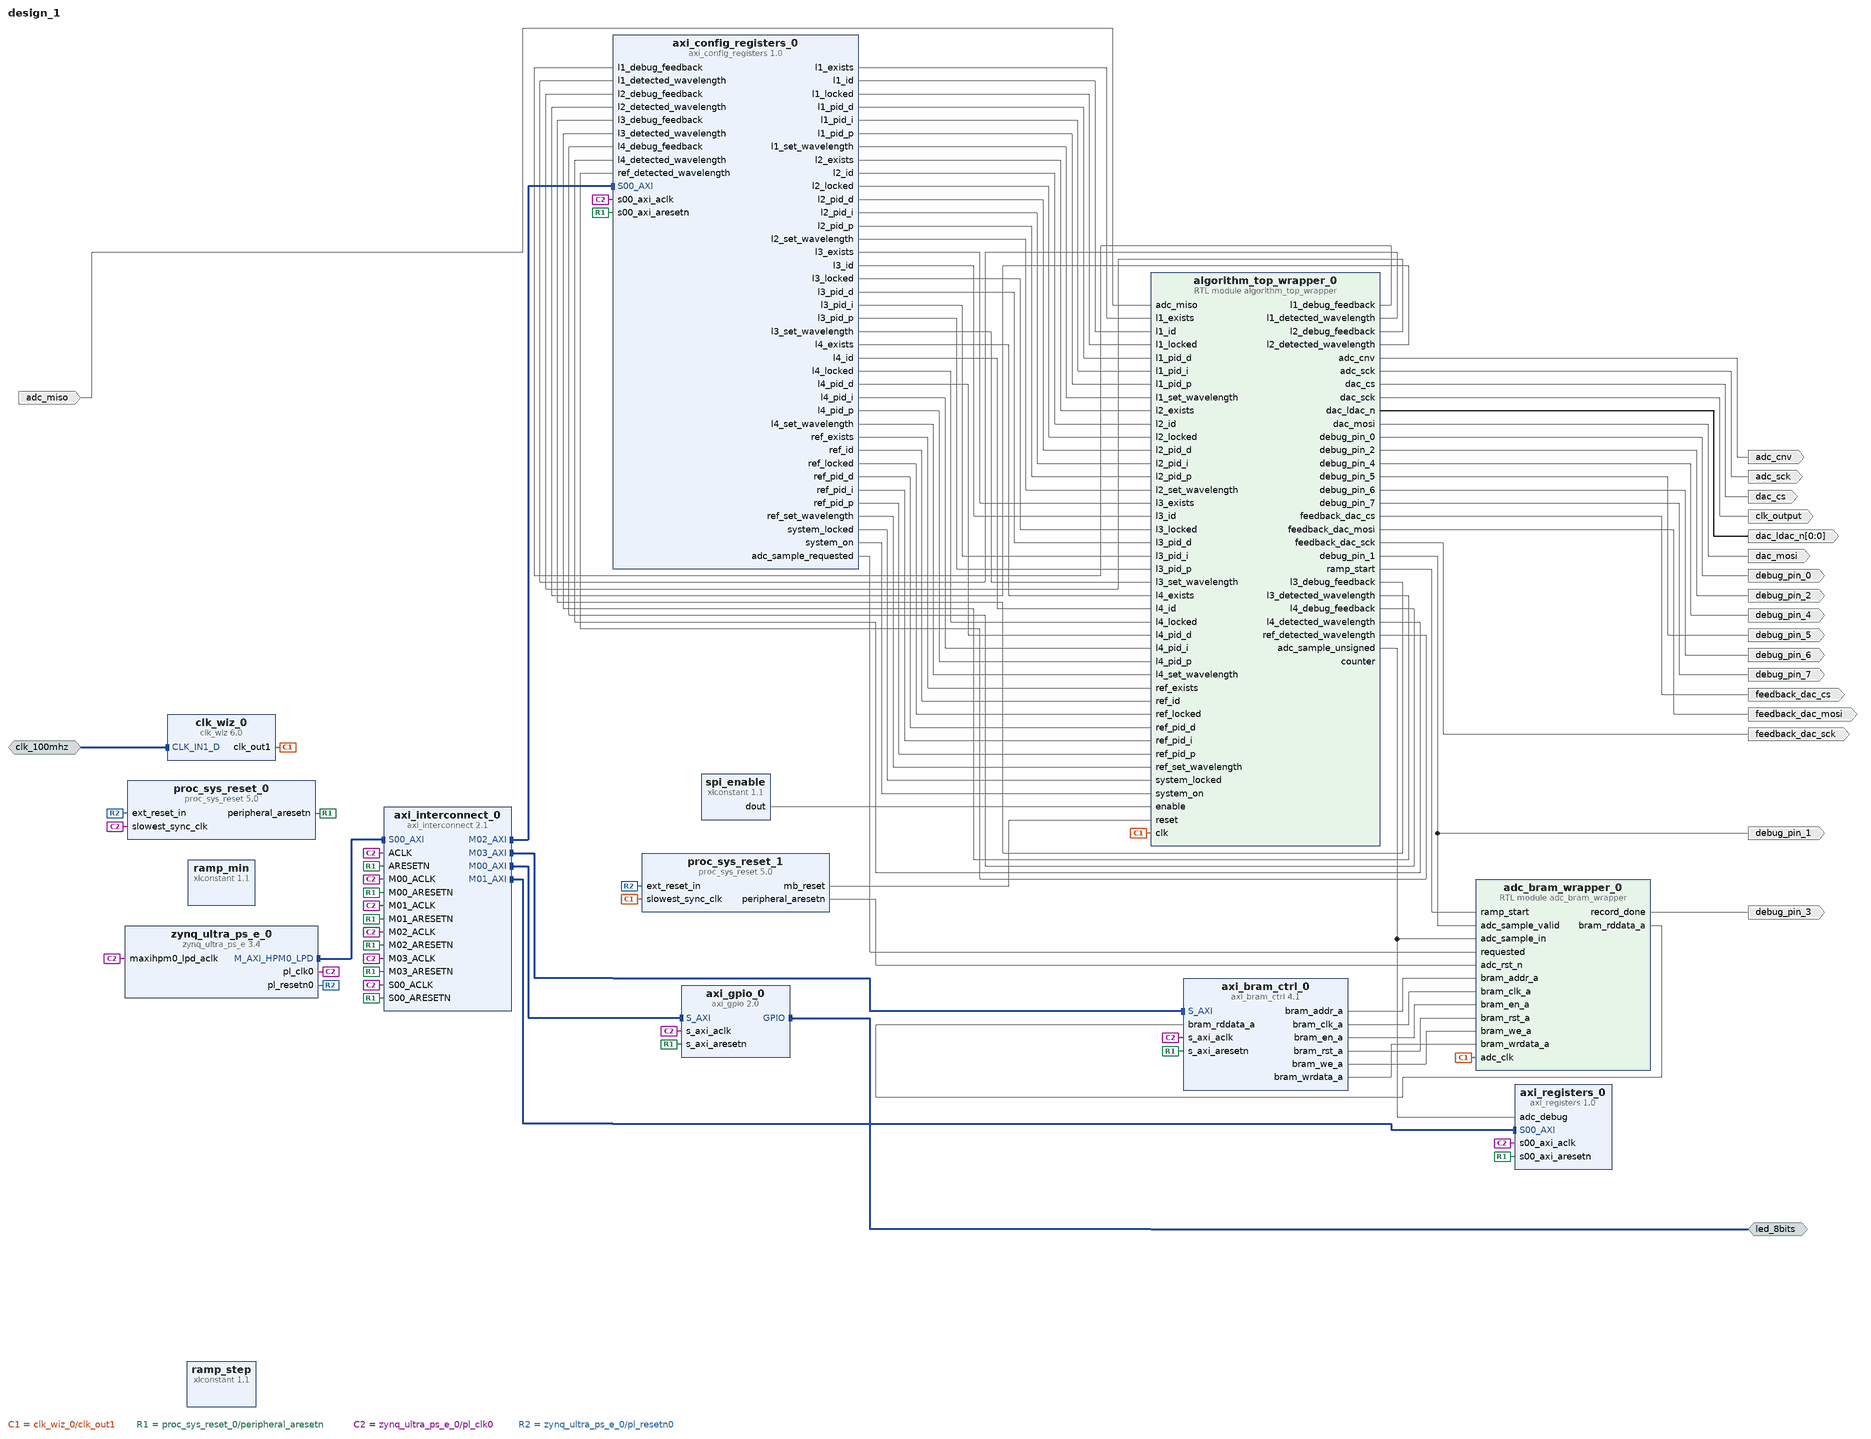
[diagram p0: block diagram of the top level]
# Vivado block design design_1, xczu3eg-sfvc784-2-e, Vivado 2022.1
create_bd_design design_1

create_bd_intf_port -mode Master -vlnv xilinx.com:interface:gpio_rtl:1.0 led_8bits
create_bd_intf_port -mode Slave -vlnv xilinx.com:interface:diff_clock_rtl:1.0 clk_100mhz
set_property -dict {CONFIG.FREQ_HZ 100000000} [get_bd_intf_ports clk_100mhz]
create_bd_port -dir O -type data clk_output
create_bd_port -dir O -type data dac_cs
create_bd_port -dir O -type data dac_mosi
create_bd_port -dir O -from 0 -to 0 -type data dac_ldac_n
create_bd_port -dir I -type data adc_miso
create_bd_port -dir O -type data adc_cnv
create_bd_port -dir O -type data adc_sck
create_bd_port -dir O -type data feedback_dac_mosi
create_bd_port -dir O -type data feedback_dac_sck
create_bd_port -dir O -type data feedback_dac_cs
create_bd_port -dir O -type data debug_pin_0
create_bd_port -dir O -type data debug_pin_1
create_bd_port -dir O -type data debug_pin_2
create_bd_port -dir O -type data debug_pin_3
create_bd_port -dir O -type data debug_pin_4
create_bd_port -dir O -type data debug_pin_5
create_bd_port -dir O -type data debug_pin_6
create_bd_port -dir O -type data debug_pin_7

create_bd_cell -type ip -vlnv xilinx.com:ip:zynq_ultra_ps_e:3.4 zynq_ultra_ps_e_0
set_property -dict [list \
  CONFIG.CAN0_BOARD_INTERFACE custom \
  CONFIG.CAN1_BOARD_INTERFACE custom \
  CONFIG.CSU_BOARD_INTERFACE custom \
  CONFIG.DP_BOARD_INTERFACE custom \
  CONFIG.GEM0_BOARD_INTERFACE custom \
  CONFIG.GEM1_BOARD_INTERFACE custom \
  CONFIG.GEM2_BOARD_INTERFACE custom \
  CONFIG.GEM3_BOARD_INTERFACE custom \
  CONFIG.GPIO_BOARD_INTERFACE custom \
  CONFIG.IIC0_BOARD_INTERFACE custom \
  CONFIG.IIC1_BOARD_INTERFACE custom \
  CONFIG.NAND_BOARD_INTERFACE custom \
  CONFIG.PCIE_BOARD_INTERFACE custom \
  CONFIG.PJTAG_BOARD_INTERFACE custom \
  CONFIG.PMU_BOARD_INTERFACE custom \
  CONFIG.PSU_BANK_0_IO_STANDARD LVCMOS33 \
  CONFIG.PSU_BANK_1_IO_STANDARD LVCMOS33 \
  CONFIG.PSU_BANK_2_IO_STANDARD LVCMOS33 \
  CONFIG.PSU_BANK_3_IO_STANDARD LVCMOS18 \
  CONFIG.PSU_USB3__DUAL_CLOCK_ENABLE 1 \
  CONFIG.PSU__CAN1__PERIPHERAL__ENABLE 0 \
  CONFIG.PSU__CRF_APB__ACPU_CTRL__FREQMHZ 1200 \
  CONFIG.PSU__CRF_APB__ACPU_CTRL__SRCSEL APLL \
  CONFIG.PSU__CRF_APB__APLL_CTRL__SRCSEL PSS_REF_CLK \
  CONFIG.PSU__CRF_APB__DBG_FPD_CTRL__FREQMHZ 250 \
  CONFIG.PSU__CRF_APB__DBG_FPD_CTRL__SRCSEL IOPLL \
  CONFIG.PSU__CRF_APB__DBG_TRACE_CTRL__FREQMHZ 250 \
  CONFIG.PSU__CRF_APB__DBG_TRACE_CTRL__SRCSEL IOPLL \
  CONFIG.PSU__CRF_APB__DBG_TSTMP_CTRL__FREQMHZ 250 \
  CONFIG.PSU__CRF_APB__DBG_TSTMP_CTRL__SRCSEL IOPLL \
  CONFIG.PSU__CRF_APB__DDR_CTRL__FREQMHZ 1200 \
  CONFIG.PSU__CRF_APB__DDR_CTRL__SRCSEL DPLL \
  CONFIG.PSU__CRF_APB__DPDMA_REF_CTRL__FREQMHZ 600 \
  CONFIG.PSU__CRF_APB__DPDMA_REF_CTRL__SRCSEL DPLL \
  CONFIG.PSU__CRF_APB__DPLL_CTRL__SRCSEL PSS_REF_CLK \
  CONFIG.PSU__CRF_APB__DP_AUDIO_REF_CTRL__SRCSEL RPLL \
  CONFIG.PSU__CRF_APB__DP_STC_REF_CTRL__SRCSEL RPLL \
  CONFIG.PSU__CRF_APB__DP_VIDEO_REF_CTRL__SRCSEL DPLL \
  CONFIG.PSU__CRF_APB__GDMA_REF_CTRL__FREQMHZ 600 \
  CONFIG.PSU__CRF_APB__GDMA_REF_CTRL__SRCSEL DPLL \
  CONFIG.PSU__CRF_APB__GPU_REF_CTRL__FREQMHZ 600 \
  CONFIG.PSU__CRF_APB__GPU_REF_CTRL__SRCSEL DPLL \
  CONFIG.PSU__CRF_APB__TOPSW_LSBUS_CTRL__FREQMHZ 100 \
  CONFIG.PSU__CRF_APB__TOPSW_LSBUS_CTRL__SRCSEL IOPLL \
  CONFIG.PSU__CRF_APB__TOPSW_MAIN_CTRL__FREQMHZ 533.333 \
  CONFIG.PSU__CRF_APB__TOPSW_MAIN_CTRL__SRCSEL DPLL \
  CONFIG.PSU__CRF_APB__VPLL_CTRL__SRCSEL PSS_REF_CLK \
  CONFIG.PSU__CRL_APB__ADMA_REF_CTRL__FREQMHZ 533.333 \
  CONFIG.PSU__CRL_APB__ADMA_REF_CTRL__SRCSEL RPLL \
  CONFIG.PSU__CRL_APB__CAN1_REF_CTRL__FREQMHZ 100 \
  CONFIG.PSU__CRL_APB__CAN1_REF_CTRL__SRCSEL IOPLL \
  CONFIG.PSU__CRL_APB__CPU_R5_CTRL__FREQMHZ 500 \
  CONFIG.PSU__CRL_APB__CPU_R5_CTRL__SRCSEL IOPLL \
  CONFIG.PSU__CRL_APB__DBG_LPD_CTRL__FREQMHZ 250 \
  CONFIG.PSU__CRL_APB__DBG_LPD_CTRL__SRCSEL IOPLL \
  CONFIG.PSU__CRL_APB__GEM3_REF_CTRL__FREQMHZ 125 \
  CONFIG.PSU__CRL_APB__GEM3_REF_CTRL__SRCSEL IOPLL \
  CONFIG.PSU__CRL_APB__I2C0_REF_CTRL__FREQMHZ 100 \
  CONFIG.PSU__CRL_APB__I2C0_REF_CTRL__SRCSEL IOPLL \
  CONFIG.PSU__CRL_APB__I2C1_REF_CTRL__FREQMHZ 100 \
  CONFIG.PSU__CRL_APB__I2C1_REF_CTRL__SRCSEL IOPLL \
  CONFIG.PSU__CRL_APB__IOPLL_CTRL__SRCSEL PSS_REF_CLK \
  CONFIG.PSU__CRL_APB__IOU_SWITCH_CTRL__FREQMHZ 267 \
  CONFIG.PSU__CRL_APB__IOU_SWITCH_CTRL__SRCSEL RPLL \
  CONFIG.PSU__CRL_APB__LPD_LSBUS_CTRL__FREQMHZ 100 \
  CONFIG.PSU__CRL_APB__LPD_LSBUS_CTRL__SRCSEL IOPLL \
  CONFIG.PSU__CRL_APB__LPD_SWITCH_CTRL__FREQMHZ 533.333 \
  CONFIG.PSU__CRL_APB__LPD_SWITCH_CTRL__SRCSEL RPLL \
  CONFIG.PSU__CRL_APB__PCAP_CTRL__FREQMHZ 200 \
  CONFIG.PSU__CRL_APB__PCAP_CTRL__SRCSEL IOPLL \
  CONFIG.PSU__CRL_APB__PL0_REF_CTRL__FREQMHZ 100 \
  CONFIG.PSU__CRL_APB__PL0_REF_CTRL__SRCSEL IOPLL \
  CONFIG.PSU__CRL_APB__QSPI_REF_CTRL__FREQMHZ 300 \
  CONFIG.PSU__CRL_APB__QSPI_REF_CTRL__SRCSEL IOPLL \
  CONFIG.PSU__CRL_APB__RPLL_CTRL__SRCSEL PSS_REF_CLK \
  CONFIG.PSU__CRL_APB__SDIO0_REF_CTRL__SRCSEL IOPLL \
  CONFIG.PSU__CRL_APB__SDIO1_REF_CTRL__FREQMHZ 200 \
  CONFIG.PSU__CRL_APB__SDIO1_REF_CTRL__SRCSEL RPLL \
  CONFIG.PSU__CRL_APB__TIMESTAMP_REF_CTRL__FREQMHZ 100 \
  CONFIG.PSU__CRL_APB__TIMESTAMP_REF_CTRL__SRCSEL PSS_REF_CLK \
  CONFIG.PSU__CRL_APB__UART0_REF_CTRL__FREQMHZ 100 \
  CONFIG.PSU__CRL_APB__UART0_REF_CTRL__SRCSEL IOPLL \
  CONFIG.PSU__CRL_APB__UART1_REF_CTRL__FREQMHZ 100 \
  CONFIG.PSU__CRL_APB__UART1_REF_CTRL__SRCSEL IOPLL \
  CONFIG.PSU__CRL_APB__USB0_BUS_REF_CTRL__FREQMHZ 250 \
  CONFIG.PSU__CRL_APB__USB0_BUS_REF_CTRL__SRCSEL IOPLL \
  CONFIG.PSU__CRL_APB__USB3_DUAL_REF_CTRL__FREQMHZ 20 \
  CONFIG.PSU__CRL_APB__USB3_DUAL_REF_CTRL__SRCSEL IOPLL \
  CONFIG.PSU__CRL_APB__USB3__ENABLE 1 \
  CONFIG.PSU__CSUPMU__PERIPHERAL__VALID 0 \
  CONFIG.PSU__DDRC__BUS_WIDTH {32 Bit} \
  CONFIG.PSU__DDRC__COMPONENTS Components \
  CONFIG.PSU__DDRC__DEVICE_CAPACITY {16384 MBits} \
  CONFIG.PSU__DDRC__DRAM_WIDTH {16 Bits} \
  CONFIG.PSU__DDRC__ECC Disabled \
  CONFIG.PSU__DDRC__MEMORY_TYPE {DDR 4} \
  CONFIG.PSU__DDRC__SPEED_BIN DDR4_2400T \
  CONFIG.PSU__DDR_HIGH_ADDRESS_GUI_ENABLE 1 \
  CONFIG.PSU__DDR__INTERFACE__FREQMHZ 600.000 \
  CONFIG.PSU__DEVICE_TYPE EG \
  CONFIG.PSU__DISPLAYPORT__LANE0__ENABLE 1 \
  CONFIG.PSU__DISPLAYPORT__LANE0__IO {GT Lane1} \
  CONFIG.PSU__DISPLAYPORT__LANE1__ENABLE 1 \
  CONFIG.PSU__DISPLAYPORT__LANE1__IO {GT Lane0} \
  CONFIG.PSU__DISPLAYPORT__PERIPHERAL__ENABLE 1 \
  CONFIG.PSU__DLL__ISUSED 1 \
  CONFIG.PSU__DPAUX__PERIPHERAL__ENABLE 1 \
  CONFIG.PSU__DPAUX__PERIPHERAL__IO {MIO 27 .. 30} \
  CONFIG.PSU__DP__LANE_SEL {Dual Lower} \
  CONFIG.PSU__DP__REF_CLK_FREQ 27 \
  CONFIG.PSU__DP__REF_CLK_SEL {Ref Clk0} \
  CONFIG.PSU__ENET3__PERIPHERAL__ENABLE 0 \
  CONFIG.PSU__FPD_SLCR__WDT1__FREQMHZ 100 \
  CONFIG.PSU__FPGA_PL0_ENABLE 1 \
  CONFIG.PSU__GPIO0_MIO__IO {MIO 0 .. 25} \
  CONFIG.PSU__GPIO0_MIO__PERIPHERAL__ENABLE 1 \
  CONFIG.PSU__GPIO1_MIO__IO {MIO 26 .. 51} \
  CONFIG.PSU__GPIO1_MIO__PERIPHERAL__ENABLE 1 \
  CONFIG.PSU__GPIO2_MIO__IO {MIO 52 .. 77} \
  CONFIG.PSU__GPIO2_MIO__PERIPHERAL__ENABLE 1 \
  CONFIG.PSU__GT__LINK_SPEED HBR \
  CONFIG.PSU__GT__PRE_EMPH_LVL_4 0 \
  CONFIG.PSU__GT__VLT_SWNG_LVL_4 0 \
  CONFIG.PSU__I2C0__PERIPHERAL__ENABLE 1 \
  CONFIG.PSU__I2C0__PERIPHERAL__IO {MIO 34 .. 35} \
  CONFIG.PSU__I2C1__PERIPHERAL__ENABLE 1 \
  CONFIG.PSU__I2C1__PERIPHERAL__IO {MIO 36 .. 37} \
  CONFIG.PSU__IOU_SLCR__IOU_TTC_APB_CLK__TTC0_SEL APB \
  CONFIG.PSU__IOU_SLCR__IOU_TTC_APB_CLK__TTC1_SEL APB \
  CONFIG.PSU__IOU_SLCR__IOU_TTC_APB_CLK__TTC2_SEL APB \
  CONFIG.PSU__IOU_SLCR__IOU_TTC_APB_CLK__TTC3_SEL APB \
  CONFIG.PSU__IOU_SLCR__TTC0__FREQMHZ 100 \
  CONFIG.PSU__IOU_SLCR__TTC1__FREQMHZ 100 \
  CONFIG.PSU__IOU_SLCR__TTC2__FREQMHZ 100 \
  CONFIG.PSU__IOU_SLCR__TTC3__FREQMHZ 100 \
  CONFIG.PSU__IOU_SLCR__WDT0__FREQMHZ 100 \
  CONFIG.PSU__LPD_SLCR__CSUPMU__FREQMHZ 100 \
  CONFIG.PSU__OVERRIDE_HPX_QOS 0 \
  CONFIG.PSU__OVERRIDE__BASIC_CLOCK 0 \
  CONFIG.PSU__PMU__PERIPHERAL__ENABLE 0 \
  CONFIG.PSU__PRESET_APPLIED 1 \
  CONFIG.PSU__PSS_REF_CLK__FREQMHZ 33.33333 \
  CONFIG.PSU__QSPI__PERIPHERAL__ENABLE 0 \
  CONFIG.PSU__SATA__PERIPHERAL__ENABLE 0 \
  CONFIG.PSU__SD0__CLK_50_SDR_ITAP_DLY 0x15 \
  CONFIG.PSU__SD0__CLK_50_SDR_OTAP_DLY 0x5 \
  CONFIG.PSU__SD0__DATA_TRANSFER_MODE 4Bit \
  CONFIG.PSU__SD0__GRP_CD__ENABLE 1 \
  CONFIG.PSU__SD0__GRP_CD__IO {MIO 24} \
  CONFIG.PSU__SD0__PERIPHERAL__ENABLE 1 \
  CONFIG.PSU__SD0__PERIPHERAL__IO {MIO 13 .. 16 21 22} \
  CONFIG.PSU__SD0__SLOT_TYPE {SD 2.0} \
  CONFIG.PSU__SD1__CLK_100_SDR_OTAP_DLY 0x00 \
  CONFIG.PSU__SD1__CLK_200_SDR_OTAP_DLY 0x00 \
  CONFIG.PSU__SD1__CLK_50_DDR_ITAP_DLY 0x00 \
  CONFIG.PSU__SD1__CLK_50_DDR_OTAP_DLY 0x00 \
  CONFIG.PSU__SD1__CLK_50_SDR_ITAP_DLY 0x00 \
  CONFIG.PSU__SD1__CLK_50_SDR_OTAP_DLY 0x00 \
  CONFIG.PSU__SD1__PERIPHERAL__ENABLE 0 \
  CONFIG.PSU__SWDT0__PERIPHERAL__ENABLE 0 \
  CONFIG.PSU__SWDT1__PERIPHERAL__ENABLE 0 \
  CONFIG.PSU__TTC0__PERIPHERAL__ENABLE 0 \
  CONFIG.PSU__TTC1__PERIPHERAL__ENABLE 0 \
  CONFIG.PSU__TTC2__PERIPHERAL__ENABLE 0 \
  CONFIG.PSU__TTC3__PERIPHERAL__ENABLE 0 \
  CONFIG.PSU__UART0__PERIPHERAL__ENABLE 0 \
  CONFIG.PSU__UART1__BAUD_RATE 115200 \
  CONFIG.PSU__UART1__MODEM__ENABLE 0 \
  CONFIG.PSU__UART1__PERIPHERAL__ENABLE 1 \
  CONFIG.PSU__UART1__PERIPHERAL__IO {MIO 32 .. 33} \
  CONFIG.PSU__USB0_COHERENCY 0 \
  CONFIG.PSU__USB0__PERIPHERAL__ENABLE 1 \
  CONFIG.PSU__USB0__PERIPHERAL__IO {MIO 52 .. 63} \
  CONFIG.PSU__USB0__REF_CLK_FREQ 100 \
  CONFIG.PSU__USB0__REF_CLK_SEL {Ref Clk1} \
  CONFIG.PSU__USB0__RESET__ENABLE 1 \
  CONFIG.PSU__USB0__RESET__IO {MIO 76} \
  CONFIG.PSU__USB1__PERIPHERAL__ENABLE 1 \
  CONFIG.PSU__USB1__PERIPHERAL__IO {MIO 64 .. 75} \
  CONFIG.PSU__USB1__REF_CLK_FREQ 100 \
  CONFIG.PSU__USB1__REF_CLK_SEL {Ref Clk1} \
  CONFIG.PSU__USB2_0__EMIO__ENABLE 0 \
  CONFIG.PSU__USB3_0__EMIO__ENABLE 0 \
  CONFIG.PSU__USB3_0__PERIPHERAL__ENABLE 1 \
  CONFIG.PSU__USB3_0__PERIPHERAL__IO {GT Lane2} \
  CONFIG.PSU__USB3_1__PERIPHERAL__ENABLE 1 \
  CONFIG.PSU__USB3_1__PERIPHERAL__IO {GT Lane3} \
  CONFIG.PSU__USB__RESET__MODE {Shared MIO Pin} \
  CONFIG.PSU__USB__RESET__POLARITY {Active Low} \
  CONFIG.PSU__USE__IRQ0 1 \
  CONFIG.PSU__USE__M_AXI_GP0 0 \
  CONFIG.PSU__USE__M_AXI_GP1 0 \
  CONFIG.PSU__USE__M_AXI_GP2 1 \
  CONFIG.QSPI_BOARD_INTERFACE custom \
  CONFIG.SATA_BOARD_INTERFACE custom \
  CONFIG.SD0_BOARD_INTERFACE custom \
  CONFIG.SD1_BOARD_INTERFACE custom \
  CONFIG.SPI0_BOARD_INTERFACE custom \
  CONFIG.SPI1_BOARD_INTERFACE custom \
  CONFIG.SUBPRESET1 Custom \
  CONFIG.SUBPRESET2 Custom \
  CONFIG.SWDT0_BOARD_INTERFACE custom \
  CONFIG.SWDT1_BOARD_INTERFACE custom \
  CONFIG.TRACE_BOARD_INTERFACE custom \
  CONFIG.TTC0_BOARD_INTERFACE custom \
  CONFIG.TTC1_BOARD_INTERFACE custom \
  CONFIG.TTC2_BOARD_INTERFACE custom \
  CONFIG.TTC3_BOARD_INTERFACE custom \
  CONFIG.UART0_BOARD_INTERFACE custom \
  CONFIG.UART1_BOARD_INTERFACE custom \
  CONFIG.USB0_BOARD_INTERFACE custom \
  CONFIG.USB1_BOARD_INTERFACE custom \
  CONFIG.preset None \
] [get_bd_cells zynq_ultra_ps_e_0]
# 765 more settings of zynq_ultra_ps_e_0 are not shown: defaults, MIO pin electricals, DDR timing, and values the tool derives
create_bd_cell -type ip -vlnv xilinx.com:ip:proc_sys_reset:5.0 proc_sys_reset_0
create_bd_cell -type ip -vlnv xilinx.com:ip:clk_wiz:6.0 clk_wiz_0
set_property -dict [list \
  CONFIG.CLKOUT1_DRIVES Buffer \
  CONFIG.CLKOUT1_JITTER 144.719 \
  CONFIG.CLKOUT1_PHASE_ERROR 114.212 \
  CONFIG.CLKOUT1_REQUESTED_OUT_FREQ 100 \
  CONFIG.CLKOUT2_DRIVES Buffer \
  CONFIG.CLKOUT2_JITTER 144.719 \
  CONFIG.CLKOUT2_PHASE_ERROR 114.212 \
  CONFIG.CLKOUT2_USED false \
  CONFIG.CLKOUT3_DRIVES Buffer \
  CONFIG.CLKOUT4_DRIVES Buffer \
  CONFIG.CLKOUT5_DRIVES Buffer \
  CONFIG.CLKOUT6_DRIVES Buffer \
  CONFIG.CLKOUT7_DRIVES Buffer \
  CONFIG.CLK_IN1_BOARD_INTERFACE clk_100mhz \
  CONFIG.MMCM_BANDWIDTH OPTIMIZED \
  CONFIG.MMCM_CLKFBOUT_MULT_F 8 \
  CONFIG.MMCM_CLKOUT0_DIVIDE_F 8 \
  CONFIG.MMCM_CLKOUT1_DIVIDE 1 \
  CONFIG.MMCM_COMPENSATION AUTO \
  CONFIG.NUM_OUT_CLKS 1 \
  CONFIG.PRIMITIVE PLL \
  CONFIG.PRIM_SOURCE Differential_clock_capable_pin \
  CONFIG.USE_BOARD_FLOW true \
  CONFIG.USE_RESET false \
] [get_bd_cells clk_wiz_0]
create_bd_cell -type ip -vlnv xilinx.com:ip:xlconstant:1.1 ramp_step
set_property -dict {CONFIG.CONST_VAL 64 CONFIG.CONST_WIDTH 16} [get_bd_cells ramp_step]
create_bd_cell -type ip -vlnv xilinx.com:ip:xlconstant:1.1 ramp_min
set_property -dict {CONFIG.CONST_VAL 0 CONFIG.CONST_WIDTH 16} [get_bd_cells ramp_min]
create_bd_cell -type ip -vlnv xilinx.com:ip:xlconstant:1.1 spi_enable
set_property -dict {CONFIG.CONST_VAL 1 CONFIG.CONST_WIDTH 1} [get_bd_cells spi_enable]
create_bd_cell -type ip -vlnv xilinx.com:ip:proc_sys_reset:5.0 proc_sys_reset_1
create_bd_cell -type ip -vlnv xilinx.com:ip:axi_gpio:2.0 axi_gpio_0
set_property -dict [list \
  CONFIG.C_GPIO2_WIDTH 28 \
  CONFIG.C_IS_DUAL 1 \
  CONFIG.GPIO_BOARD_INTERFACE led_8bits \
  CONFIG.USE_BOARD_FLOW true \
] [get_bd_cells axi_gpio_0]
create_bd_cell -type ip -vlnv xilinx.com:ip:axi_interconnect:2.1 axi_interconnect_0
set_property -dict {CONFIG.NUM_MI 4} [get_bd_cells axi_interconnect_0]
create_bd_cell -type ip -vlnv user.org:user:axi_registers:1.0 axi_registers_0
create_bd_cell -type ip -vlnv xilinx.com:ip:axi_bram_ctrl:4.1 axi_bram_ctrl_0
set_property -dict {CONFIG.SINGLE_PORT_BRAM 1} [get_bd_cells axi_bram_ctrl_0]
create_bd_cell -type module -reference adc_bram_wrapper adc_bram_wrapper_0
create_bd_cell -type ip -vlnv user.org:user:axi_config_registers:1.0 axi_config_registers_0
create_bd_cell -type module -reference algorithm_top_wrapper algorithm_top_wrapper_0

# ---- connections ----

connect_bd_intf_net [get_bd_intf_ports led_8bits] [get_bd_intf_pins axi_gpio_0/GPIO]
connect_bd_intf_net [get_bd_intf_pins axi_interconnect_0/M00_AXI] [get_bd_intf_pins axi_gpio_0/S_AXI]
connect_bd_intf_net [get_bd_intf_pins axi_registers_0/S00_AXI] [get_bd_intf_pins axi_interconnect_0/M01_AXI]
connect_bd_intf_net [get_bd_intf_pins axi_interconnect_0/M02_AXI] [get_bd_intf_pins axi_config_registers_0/S00_AXI]
connect_bd_intf_net [get_bd_intf_pins axi_interconnect_0/M03_AXI] [get_bd_intf_pins axi_bram_ctrl_0/S_AXI]
connect_bd_intf_net [get_bd_intf_ports clk_100mhz] [get_bd_intf_pins clk_wiz_0/CLK_IN1_D]
connect_bd_intf_net [get_bd_intf_pins zynq_ultra_ps_e_0/M_AXI_HPM0_LPD] [get_bd_intf_pins axi_interconnect_0/S00_AXI]
connect_bd_net [get_bd_pins adc_bram_wrapper_0/bram_rddata_a] [get_bd_pins axi_bram_ctrl_0/bram_rddata_a]
connect_bd_net [get_bd_pins adc_bram_wrapper_0/record_done] [get_bd_ports debug_pin_3]
connect_bd_net -net adc_frontend_wrapper_0_adc_sample_unsigned [get_bd_pins algorithm_top_wrapper_0/adc_sample_unsigned] \
  [get_bd_pins axi_registers_0/adc_debug] [get_bd_pins adc_bram_wrapper_0/adc_sample_in]
connect_bd_net [get_bd_ports adc_miso] [get_bd_pins algorithm_top_wrapper_0/adc_miso]
connect_bd_net [get_bd_pins algorithm_top_wrapper_0/adc_cnv] [get_bd_ports adc_cnv]
connect_bd_net [get_bd_pins algorithm_top_wrapper_0/adc_sck] [get_bd_ports adc_sck]
# net algorithm_top_wrapper_0_counter has one end: algorithm_top_wrapper_0/counter
connect_bd_net [get_bd_pins algorithm_top_wrapper_0/dac_cs] [get_bd_ports dac_cs]
connect_bd_net [get_bd_pins algorithm_top_wrapper_0/dac_ldac_n] [get_bd_ports dac_ldac_n]
connect_bd_net [get_bd_pins algorithm_top_wrapper_0/dac_mosi] [get_bd_ports dac_mosi]
connect_bd_net [get_bd_pins algorithm_top_wrapper_0/dac_sck] [get_bd_ports clk_output]
connect_bd_net [get_bd_pins algorithm_top_wrapper_0/debug_pin_0] [get_bd_ports debug_pin_0]
connect_bd_net [get_bd_pins algorithm_top_wrapper_0/debug_pin_1] [get_bd_ports debug_pin_1] [get_bd_pins adc_bram_wrapper_0/adc_sample_valid]
connect_bd_net [get_bd_pins algorithm_top_wrapper_0/debug_pin_2] [get_bd_ports debug_pin_2]
connect_bd_net [get_bd_pins algorithm_top_wrapper_0/debug_pin_4] [get_bd_ports debug_pin_4]
connect_bd_net [get_bd_pins algorithm_top_wrapper_0/debug_pin_5] [get_bd_ports debug_pin_5]
connect_bd_net [get_bd_pins algorithm_top_wrapper_0/debug_pin_6] [get_bd_ports debug_pin_6]
connect_bd_net [get_bd_pins algorithm_top_wrapper_0/debug_pin_7] [get_bd_ports debug_pin_7]
connect_bd_net [get_bd_pins algorithm_top_wrapper_0/feedback_dac_cs] [get_bd_ports feedback_dac_cs]
connect_bd_net [get_bd_pins algorithm_top_wrapper_0/feedback_dac_mosi] [get_bd_ports feedback_dac_mosi]
connect_bd_net [get_bd_pins algorithm_top_wrapper_0/feedback_dac_sck] [get_bd_ports feedback_dac_sck]
connect_bd_net [get_bd_pins algorithm_top_wrapper_0/l1_debug_feedback] [get_bd_pins axi_config_registers_0/l1_debug_feedback]
connect_bd_net [get_bd_pins algorithm_top_wrapper_0/l1_detected_wavelength] [get_bd_pins axi_config_registers_0/l1_detected_wavelength]
connect_bd_net [get_bd_pins algorithm_top_wrapper_0/l2_debug_feedback] [get_bd_pins axi_config_registers_0/l2_debug_feedback]
connect_bd_net [get_bd_pins algorithm_top_wrapper_0/l2_detected_wavelength] [get_bd_pins axi_config_registers_0/l2_detected_wavelength]
connect_bd_net [get_bd_pins algorithm_top_wrapper_0/l3_debug_feedback] [get_bd_pins axi_config_registers_0/l3_debug_feedback]
connect_bd_net [get_bd_pins algorithm_top_wrapper_0/l3_detected_wavelength] [get_bd_pins axi_config_registers_0/l3_detected_wavelength]
connect_bd_net [get_bd_pins algorithm_top_wrapper_0/l4_debug_feedback] [get_bd_pins axi_config_registers_0/l4_debug_feedback]
connect_bd_net [get_bd_pins algorithm_top_wrapper_0/l4_detected_wavelength] [get_bd_pins axi_config_registers_0/l4_detected_wavelength]
connect_bd_net [get_bd_pins algorithm_top_wrapper_0/ramp_start] [get_bd_pins adc_bram_wrapper_0/ramp_start]
connect_bd_net [get_bd_pins algorithm_top_wrapper_0/ref_detected_wavelength] [get_bd_pins axi_config_registers_0/ref_detected_wavelength]
connect_bd_net [get_bd_pins axi_bram_ctrl_0/bram_addr_a] [get_bd_pins adc_bram_wrapper_0/bram_addr_a]
connect_bd_net [get_bd_pins axi_bram_ctrl_0/bram_clk_a] [get_bd_pins adc_bram_wrapper_0/bram_clk_a]
connect_bd_net [get_bd_pins axi_bram_ctrl_0/bram_en_a] [get_bd_pins adc_bram_wrapper_0/bram_en_a]
connect_bd_net [get_bd_pins axi_bram_ctrl_0/bram_rst_a] [get_bd_pins adc_bram_wrapper_0/bram_rst_a]
connect_bd_net [get_bd_pins axi_bram_ctrl_0/bram_we_a] [get_bd_pins adc_bram_wrapper_0/bram_we_a]
connect_bd_net [get_bd_pins axi_bram_ctrl_0/bram_wrdata_a] [get_bd_pins adc_bram_wrapper_0/bram_wrdata_a]
connect_bd_net [get_bd_pins axi_config_registers_0/adc_sample_requested] [get_bd_pins adc_bram_wrapper_0/requested]
connect_bd_net [get_bd_pins axi_config_registers_0/l1_exists] [get_bd_pins algorithm_top_wrapper_0/l1_exists]
connect_bd_net [get_bd_pins axi_config_registers_0/l1_id] [get_bd_pins algorithm_top_wrapper_0/l1_id]
connect_bd_net [get_bd_pins axi_config_registers_0/l1_locked] [get_bd_pins algorithm_top_wrapper_0/l1_locked]
connect_bd_net [get_bd_pins axi_config_registers_0/l1_pid_d] [get_bd_pins algorithm_top_wrapper_0/l1_pid_d]
connect_bd_net [get_bd_pins axi_config_registers_0/l1_pid_i] [get_bd_pins algorithm_top_wrapper_0/l1_pid_i]
connect_bd_net [get_bd_pins axi_config_registers_0/l1_pid_p] [get_bd_pins algorithm_top_wrapper_0/l1_pid_p]
connect_bd_net [get_bd_pins axi_config_registers_0/l1_set_wavelength] [get_bd_pins algorithm_top_wrapper_0/l1_set_wavelength]
connect_bd_net [get_bd_pins axi_config_registers_0/l2_exists] [get_bd_pins algorithm_top_wrapper_0/l2_exists]
connect_bd_net [get_bd_pins axi_config_registers_0/l2_id] [get_bd_pins algorithm_top_wrapper_0/l2_id]
connect_bd_net [get_bd_pins axi_config_registers_0/l2_locked] [get_bd_pins algorithm_top_wrapper_0/l2_locked]
connect_bd_net [get_bd_pins axi_config_registers_0/l2_pid_d] [get_bd_pins algorithm_top_wrapper_0/l2_pid_d]
connect_bd_net [get_bd_pins axi_config_registers_0/l2_pid_i] [get_bd_pins algorithm_top_wrapper_0/l2_pid_i]
connect_bd_net [get_bd_pins axi_config_registers_0/l2_pid_p] [get_bd_pins algorithm_top_wrapper_0/l2_pid_p]
connect_bd_net [get_bd_pins axi_config_registers_0/l2_set_wavelength] [get_bd_pins algorithm_top_wrapper_0/l2_set_wavelength]
connect_bd_net [get_bd_pins axi_config_registers_0/l3_exists] [get_bd_pins algorithm_top_wrapper_0/l3_exists]
connect_bd_net [get_bd_pins axi_config_registers_0/l3_id] [get_bd_pins algorithm_top_wrapper_0/l3_id]
connect_bd_net [get_bd_pins axi_config_registers_0/l3_locked] [get_bd_pins algorithm_top_wrapper_0/l3_locked]
connect_bd_net [get_bd_pins axi_config_registers_0/l3_pid_d] [get_bd_pins algorithm_top_wrapper_0/l3_pid_d]
connect_bd_net [get_bd_pins axi_config_registers_0/l3_pid_i] [get_bd_pins algorithm_top_wrapper_0/l3_pid_i]
connect_bd_net [get_bd_pins axi_config_registers_0/l3_pid_p] [get_bd_pins algorithm_top_wrapper_0/l3_pid_p]
connect_bd_net [get_bd_pins axi_config_registers_0/l3_set_wavelength] [get_bd_pins algorithm_top_wrapper_0/l3_set_wavelength]
connect_bd_net [get_bd_pins axi_config_registers_0/l4_exists] [get_bd_pins algorithm_top_wrapper_0/l4_exists]
connect_bd_net [get_bd_pins axi_config_registers_0/l4_id] [get_bd_pins algorithm_top_wrapper_0/l4_id]
connect_bd_net [get_bd_pins axi_config_registers_0/l4_locked] [get_bd_pins algorithm_top_wrapper_0/l4_locked]
connect_bd_net [get_bd_pins axi_config_registers_0/l4_pid_d] [get_bd_pins algorithm_top_wrapper_0/l4_pid_d]
connect_bd_net [get_bd_pins axi_config_registers_0/l4_pid_i] [get_bd_pins algorithm_top_wrapper_0/l4_pid_i]
connect_bd_net [get_bd_pins axi_config_registers_0/l4_pid_p] [get_bd_pins algorithm_top_wrapper_0/l4_pid_p]
connect_bd_net [get_bd_pins axi_config_registers_0/l4_set_wavelength] [get_bd_pins algorithm_top_wrapper_0/l4_set_wavelength]
connect_bd_net [get_bd_pins axi_config_registers_0/ref_exists] [get_bd_pins algorithm_top_wrapper_0/ref_exists]
connect_bd_net [get_bd_pins axi_config_registers_0/ref_id] [get_bd_pins algorithm_top_wrapper_0/ref_id]
connect_bd_net [get_bd_pins axi_config_registers_0/ref_locked] [get_bd_pins algorithm_top_wrapper_0/ref_locked]
connect_bd_net [get_bd_pins axi_config_registers_0/ref_pid_d] [get_bd_pins algorithm_top_wrapper_0/ref_pid_d]
connect_bd_net [get_bd_pins axi_config_registers_0/ref_pid_i] [get_bd_pins algorithm_top_wrapper_0/ref_pid_i]
connect_bd_net [get_bd_pins axi_config_registers_0/ref_pid_p] [get_bd_pins algorithm_top_wrapper_0/ref_pid_p]
connect_bd_net [get_bd_pins axi_config_registers_0/ref_set_wavelength] [get_bd_pins algorithm_top_wrapper_0/ref_set_wavelength]
connect_bd_net [get_bd_pins axi_config_registers_0/system_locked] [get_bd_pins algorithm_top_wrapper_0/system_locked]
connect_bd_net [get_bd_pins axi_config_registers_0/system_on] [get_bd_pins algorithm_top_wrapper_0/system_on]
connect_bd_net [get_bd_pins clk_wiz_0/clk_out1] \
  [get_bd_pins proc_sys_reset_1/slowest_sync_clk] [get_bd_pins adc_bram_wrapper_0/adc_clk] \
  [get_bd_pins algorithm_top_wrapper_0/clk]
connect_bd_net [get_bd_pins proc_sys_reset_0/peripheral_aresetn] \
  [get_bd_pins axi_interconnect_0/ARESETN] [get_bd_pins axi_interconnect_0/S00_ARESETN] \
  [get_bd_pins axi_interconnect_0/M00_ARESETN] [get_bd_pins axi_interconnect_0/M01_ARESETN] \
  [get_bd_pins axi_interconnect_0/M02_ARESETN] [get_bd_pins axi_registers_0/s00_axi_aresetn] \
  [get_bd_pins axi_bram_ctrl_0/s_axi_aresetn] [get_bd_pins axi_gpio_0/s_axi_aresetn] \
  [get_bd_pins axi_interconnect_0/M03_ARESETN] [get_bd_pins axi_config_registers_0/s00_axi_aresetn]
connect_bd_net [get_bd_pins proc_sys_reset_1/mb_reset] [get_bd_pins algorithm_top_wrapper_0/reset]
connect_bd_net [get_bd_pins proc_sys_reset_1/peripheral_aresetn] [get_bd_pins adc_bram_wrapper_0/adc_rst_n]
connect_bd_net -net triangle_mode_dout [get_bd_pins spi_enable/dout] [get_bd_pins algorithm_top_wrapper_0/enable]
connect_bd_net [get_bd_pins zynq_ultra_ps_e_0/pl_clk0] \
  [get_bd_pins proc_sys_reset_0/slowest_sync_clk] [get_bd_pins zynq_ultra_ps_e_0/maxihpm0_lpd_aclk] \
  [get_bd_pins axi_interconnect_0/ACLK] [get_bd_pins axi_interconnect_0/S00_ACLK] [get_bd_pins axi_interconnect_0/M00_ACLK] \
  [get_bd_pins axi_interconnect_0/M01_ACLK] [get_bd_pins axi_interconnect_0/M02_ACLK] \
  [get_bd_pins axi_registers_0/s00_axi_aclk] [get_bd_pins axi_bram_ctrl_0/s_axi_aclk] [get_bd_pins axi_gpio_0/s_axi_aclk] \
  [get_bd_pins axi_interconnect_0/M03_ACLK] [get_bd_pins axi_config_registers_0/s00_axi_aclk]
connect_bd_net [get_bd_pins zynq_ultra_ps_e_0/pl_resetn0] [get_bd_pins proc_sys_reset_0/ext_reset_in] [get_bd_pins proc_sys_reset_1/ext_reset_in]

# ---- address map ----
assign_bd_address -offset 0x0080000000 -range 64K -target_address_space [get_bd_addr_spaces zynq_ultra_ps_e_0/Data] [get_bd_addr_segs axi_gpio_0/S_AXI/Reg]
assign_bd_address -offset 0x0080010000 -range 64K -target_address_space [get_bd_addr_spaces zynq_ultra_ps_e_0/Data] [get_bd_addr_segs axi_registers_0/S00_AXI/S00_AXI_reg]
assign_bd_address -offset 0x0080020000 -range 64K -target_address_space [get_bd_addr_spaces zynq_ultra_ps_e_0/Data] [get_bd_addr_segs axi_config_registers_0/S00_AXI/S00_AXI_reg]
assign_bd_address -offset 0x0082000000 -range 64K -target_address_space [get_bd_addr_spaces zynq_ultra_ps_e_0/Data] [get_bd_addr_segs axi_bram_ctrl_0/S_AXI/Mem0]

validate_bd_design
save_bd_design
